# Altium project CW308T_LPC1343.PrjPcb
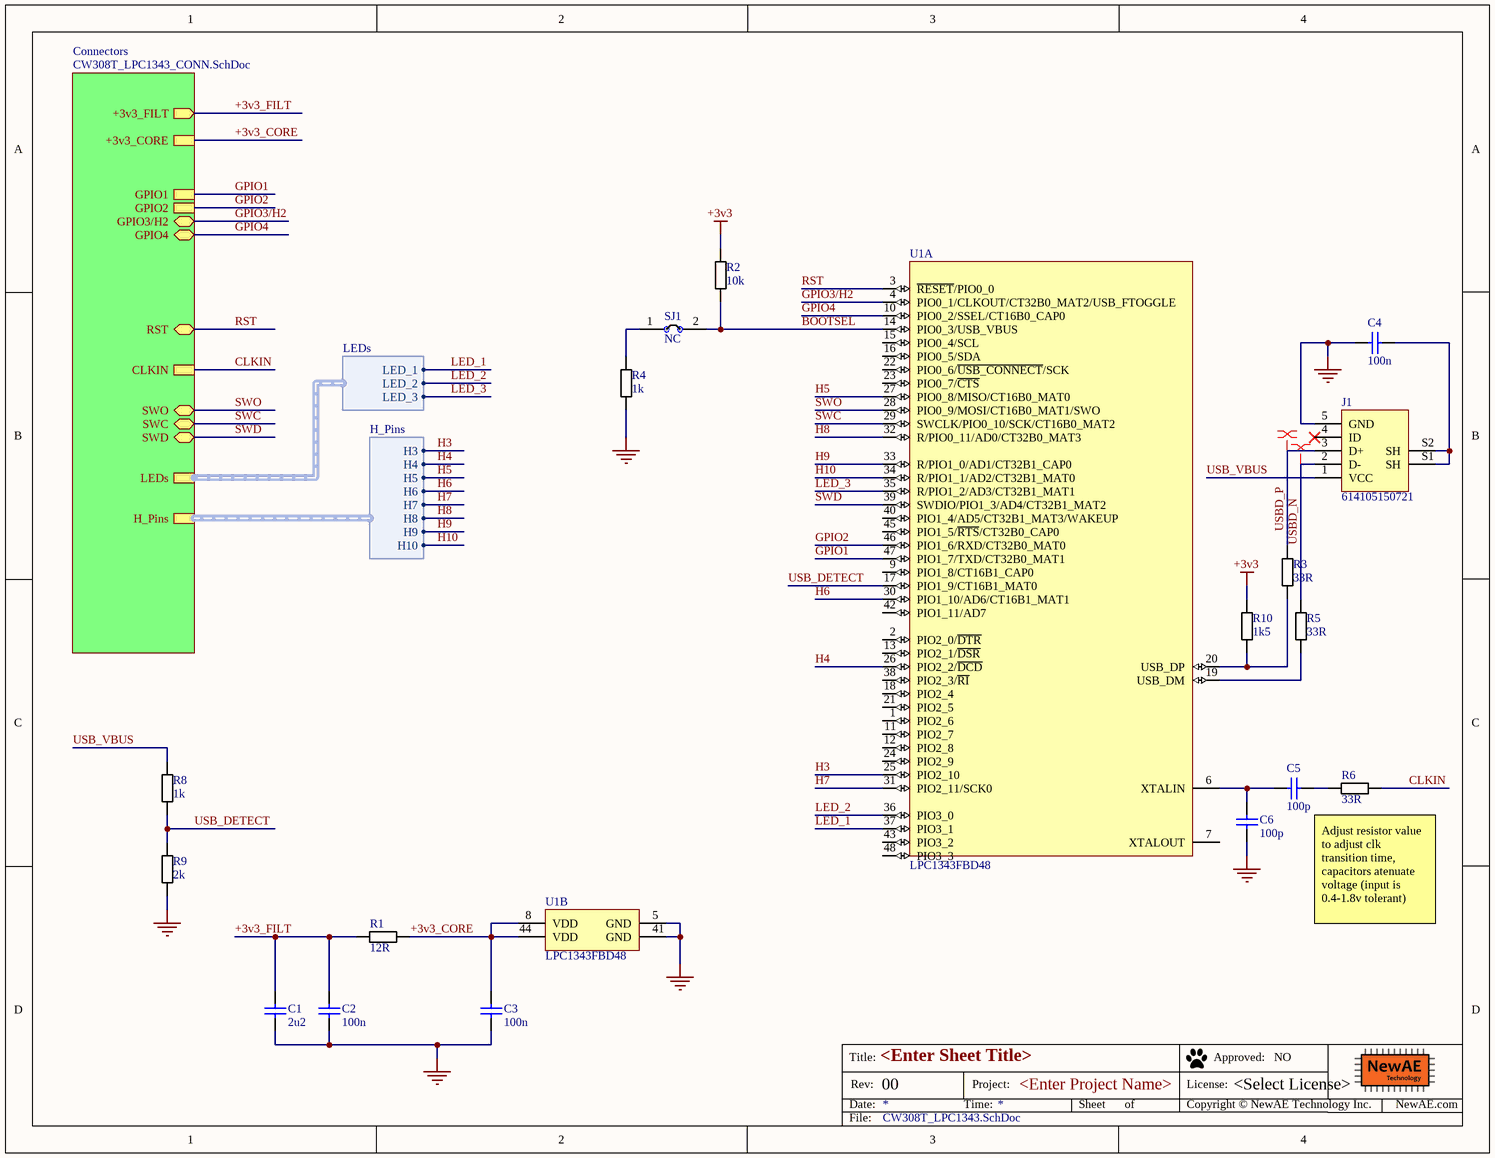
[diagram p0: CW308T_LPC1343.SchDoc]
PrjLicense: <Select License>; PrjName: <Enter Project Name>; PrjRev: 00
2 sheets, 20 parts. Net scope: hierarchical (ports join the sheet entries above them; power ports are global).
Board files: CW308T_LPC1343.PcbDoc, CW308T_LPC1343_PANEL.PcbDoc
Sheets:
  CW308T_LPC1343.SchDoc
    Connectors = CW308T_LPC1343_CONN.SchDoc

## Sheet CW308T_LPC1343.SchDoc: <Enter Sheet Title>
size Letter; Organization: NewAE Technology Inc.; Address1: 1083 Queen St., Suite 196; Address2: Halifax; Address3: NS; Address4: Canada B3H 0B2; SheetApproved: NO

### Parts
C1  2u2  [CAPC0603_M]
C2  100n  [CAPC0603_M]
C3  100n  [CAPC0603_M]
C4  100n  [CAPC0603_M]
C5  100p  [CAPC0603_M]
C6  100p  [CAPC0603_M]
J1  614105150721  [614105150721]
R1  12R  [RESC1608X55N]
R2  10k  [RESC1608X55N]
R3  33R  [RESC1608X55N]
R4  1k  [RESC1608X55N]
R5  33R  [RESC1608X55N]
R6  33R  [RESC1608X55N]
R8  1k  [RESC1608X55N]
R9  2k  [RESC1608X55N]
R10  1k5  [RESC1608X55N]
SJ1  NC  [SJ_2S_NC]  (no BOM)
U1  LPC1343FBD48  (parts A,B of 2)

### Sub-sheets
Connectors = CW308T_LPC1343_CONN.SchDoc: +3v3_CORE, GPIO1, GPIO2, RST (bidir), CLKIN, GPIO3/H2 (bidir), GPIO4 (bidir), SWO (bidir), SWC (bidir), SWD (bidir), +3v3_FILT (out), H_Pins (harness H_Pins), LEDs (harness LEDs)

### Harnesses
H_Pins: H3, H4, H5, H6, H7, H8, H9, H10
LEDs: LED_1, LED_2, LED_3

### Nets
+3v3: R2.1 R10.1
GND: C1.2 C2.2 C3.2 C4.1 C6.2 J1.5(GND) R4.2 R9.2 U1.5(GND) U1.41(GND)
+3v3_CORE: C3.1 R1.2 U1.8(VDD) U1.44(VDD) ; sheet Connectors/+3v3_CORE
+3v3_FILT: C1.1 C2.1 R1.1 ; sheet Connectors/+3v3_FILT
BOOTSEL: R2.2 SJ1.2 U1.14(PIO0_3/USB_VBUS)
CLKIN: R6.2 ; sheet Connectors/CLKIN
GPIO1: U1.47(PIO1_7/TXD/CT32B0_MAT1) ; sheet Connectors/GPIO1
GPIO2: U1.46(PIO1_6/RXD/CT32B0_MAT0) ; sheet Connectors/GPIO2
GPIO3/H2: U1.4(PIO0_1/CLKOUT/CT32B0_MAT2/USB_FTOGGLE) ; sheet Connectors/GPIO3/H2
GPIO4: U1.10(PIO0_2/SSEL/CT16B0_CAP0) ; sheet Connectors/GPIO4
H3: U1.25(PIO2_10) ; sheet Connectors/H_Pins.H3
H4: U1.26(PIO2_2/~{DCD}) ; sheet Connectors/H_Pins.H4
H5: U1.27(PIO0_8/MISO/CT16B0_MAT0) ; sheet Connectors/H_Pins.H5
H6: U1.30(PIO1_10/AD6/CT16B1_MAT1) ; sheet Connectors/H_Pins.H6
H7: U1.31(PIO2_11/SCK0) ; sheet Connectors/H_Pins.H7
H8: U1.32(R/PIO0_11/AD0/CT32B0_MAT3) ; sheet Connectors/H_Pins.H8
H9: U1.33(R/PIO1_0/AD1/CT32B1_CAP0) ; sheet Connectors/H_Pins.H9
H10: U1.34(R/PIO1_1/AD2/CT32B1_MAT0) ; sheet Connectors/H_Pins.H10
LED_1: U1.37(PIO3_1) ; sheet Connectors/LEDs.LED_1
LED_2: U1.36(PIO3_0) ; sheet Connectors/LEDs.LED_2
LED_3: U1.35(R/PIO1_2/AD3/CT32B1_MAT1) ; sheet Connectors/LEDs.LED_3
RST: U1.3(~{RESET}/PIO0_0) ; sheet Connectors/RST
SWC: U1.29(SWCLK/PIO0_10/SCK/CT16B0_MAT2) ; sheet Connectors/SWC
SWD: U1.39(SWDIO/PIO1_3/AD4/CT32B1_MAT2) ; sheet Connectors/SWD
SWO: U1.28(PIO0_9/MOSI/CT16B0_MAT1/SWO) ; sheet Connectors/SWO
USB_DETECT: R8.2 R9.1 U1.17(PIO1_9/CT16B1_MAT0)
USB_VBUS: J1.1(VCC) R8.1
USBD_N: J1.2(D-) R5.1
USBD_P: J1.3(D+) R3.1
NetC4_2: C4.2 J1.S1(SH) J1.S2(SH)
NetC5_1: C5.1 C6.1 U1.6(XTALIN)
NetC5_2: C5.2 R6.1
NetR3_2: R3.2 R10.2 U1.20(USB_DP)
NetR4_1: R4.1 SJ1.1
NetR5_2: R5.2 U1.19(USB_DM)

Not connected (* = marked no-connect by the designer): J1 4(ID)*; U1 1(PIO2_6) 2(PIO2_0/~{DTR}) 7(XTALOUT) 9(PIO1_8/CT16B1_CAP0) 11(PIO2_7) 12(PIO2_8) 13(PIO2_1/~{DSR}) 15(PIO0_4/SCL) 16(PIO0_5/SDA) 18(PIO2_4) 21(PIO2_5) 22(PIO0_6/~{USB_CONNECT}/SCK) 23(PIO0_7/~{CTS}) 24(PIO2_9) 38(PIO2_3/~{RI}) 40(PIO1_4/AD5/CT32B1_MAT3/WAKEUP) 42(PIO1_11/AD7) 43(PIO3_2) 45(PIO1_5/~{RTS}/CT32B0_CAP0) 48(PIO3_3)

### Layout directives
differential pair: USBD_N, USBD_P

### Notes on the sheet
- Adjust resistor value to adjust clk transition time, capacitors atenuate voltage (input is 0.4-1.8v tolerant)
- Title:
- Date:
- Rev:
- Time:
- Project:
- Sheet
- of
- License:
- Copyright © NewAE Technology Inc.
- Approved:
- NewAE.com
- File:

### Library data of the parts
C1 = CCHIP-2u2-0603: 2u2, 0603; Manufacture 1: Samsung; Manufacture Part Number 1: CL10B225KP8NNNC; Component Group: Capacitor; Case-EIA: 0603; Case-Metric: 1608; Rated Voltage: 10VDC; Part Number: CCHIP-2u2-0603; Footprint: 0603; Pin Count: 2; Supplier 1: Digi-Key; Supplier Part Number 1: 1276-1134-2-ND; Value: 2u2; Mounting Technology: SMT; Component Kind: Standard; Component Type: Standard
C2-C4 = CCHIP-100n-0603: 100n, 0603; Manufacture 1: Kemet; Manufacture Part Number 1: C0603C104K5RACTU; Component Group: Capacitor; Case-EIA: 0603; Case-Metric: 1608; Rated Voltage: 50VDC; Part Number: CCHIP-100n-0603; Footprint: 0603; Pin Count: 2; Supplier 1: Digi-Key; Supplier Part Number 1: 399-5089-2-ND; Value: 100n; Mounting Technology: SMT; Component Kind: Standard; Component Type: Standard
C5 C6 = CCHIP-100p-0603: 100p, 0603; Manufacture 1: KEMET; Manufacture Part Number 1: C0603C101K5RACTU; Component Group: Capacitor; Case-EIA: 0603; Case-Metric: 1608; Rated Voltage: 50V; Part Number: CCHIP-100p-0603; Footprint: 0603; Pin Count: 2; Supplier 1: Digi-Key; Supplier Part Number 1: 399-7824-1-ND; Value: 100p; Mounting Technology: SMT; RoHS: Yes; Component Kind: Standard; Component Type: Standard
J1 = 614105150721: USB, 5-pin, Upright; Manufacture 1: Wurth Electronics; Component Group: Connector; PP Material Stack: 0; Part Number: 614105150721; Manufacture Part Number 1: 614105150721; Pin Count: 7; Supplier 1: Digi-Key; Supplier Part Number 1: 732-5958-1-ND; Mounting Technology: Through-hole; RoHS: Yes; Component Kind: Standard; Component Type: Standard; PP Rotation: 0
R1 = RCHIP-12R-0603: 12R res, 0603, 1%, 1/10W; Manufacture 1: Yageo; Manufacture Part Number 1: RC0603FR-0712RL; Component Group: Resistor; Case-EIA: 0603; Case-Metric: 1608; Rated Power: 0.1W; Rated Voltage: 75VDC; Part Number: RCHIP-12R-0603; Footprint: 0603; Pin Count: 2; Supplier 1: Digi-Key; Supplier Part Number 1: 311-12.0HRCT-ND; Value: 12R; Tolerance: 1%; Mounting Technology: SMT; Temperature Range: -55C to 155C; Component Kind: Standard; Component Type: Standard
R2 = RCHIP-10K-0603: 10k res, 0603, 1%, 1/10W; Manufacture 1: Yageo; Manufacture Part Number 1: RC0603FR-0710KL; Component Group: Resistor; Case-EIA: 0603; Case-Metric: 1608; Rated Power: 0.1W; Rated Voltage: 75VDC; Part Number: RCHIP-10K-0603; Footprint: 0603; Pin Count: 2; Supplier 1: Digi-Key; Supplier Part Number 1: 311-10.0KHRCT-ND; Value: 10k; Tolerance: 1%; Mounting Technology: SMT; Temperature Range: -55C to 155C; Component Kind: Standard; Component Type: Standard
R3 R5 R6 = RCHIP-33R-0603: 33R res, 0603, 1%, 1/10W; Manufacture 1: Yageo; Manufacture Part Number 1: RC0603FR-0733RL; Component Group: Resistor; Case-EIA: 0603; Case-Metric: 1608; Rated Power: 0.1W; Rated Voltage: 75VDC; Part Number: RCHIP-33R-0603; Footprint: 0603; Pin Count: 2; Supplier 1: Digi-Key; Supplier Part Number 1: 311-33.0HRCT-ND; Value: 33R; Tolerance: 1%; Mounting Technology: SMT; Temperature Range: -55C to 155C; Component Kind: Standard; Component Type: Standard
R4 R8 = RCHIP-1K-0603: 1k res, 0603, 1%, 1/10W; Manufacture 1: Yageo; Manufacture Part Number 1: RC0603FR-071KL; Component Group: Resistor; Case-EIA: 0603; Case-Metric: 1608; Rated Power: 0.1W; Rated Voltage: 75VDC; Part Number: RCHIP-1K-0603; Footprint: 0603; Pin Count: 2; Supplier 1: Digi-Key; Supplier Part Number 1: 311-1.00KHRCT-ND; Value: 1k; Tolerance: 1%; Mounting Technology: SMT; Temperature Range: -55C to 155C; Component Kind: Standard; Component Type: Standard
R9 = RCHIP-2K-0603: 2k res, 0603, 1%, 1/10W; Manufacture 1: Yageo; Manufacture Part Number 1: RC0603FR-072KL; Component Group: Resistor; Case-EIA: 0603; Case-Metric: 1608; Rated Power: 0.1W; Rated Voltage: 75VDC; Part Number: RCHIP-2K-0603; Footprint: 0603; Pin Count: 2; Supplier 1: Digi-Key; Supplier Part Number 1: 311-2.00KHRCT-ND; Value: 2k; Tolerance: 1%; Mounting Technology: SMT; Temperature Range: -55C to 155C; Component Kind: Standard; Component Type: Standard
R10 = RCHIP-1K5-0603: 1k5 res, 0603, 1%, 1/10W; Manufacture 1: Yageo; Manufacture Part Number 1: RC0603FR-071K5L; Component Group: Resistor; Case-EIA: 0603; Case-Metric: 1608; Rated Power: 0.1W; Rated Voltage: 75VDC; Part Number: RCHIP-1K5-0603; Footprint: 0603; Pin Count: 2; Supplier 1: Digi-Key; Supplier Part Number 1: 311-1.50KHRCT-ND; Value: 1k5; Tolerance: 1%; Mounting Technology: SMT; Temperature Range: -55C to 155C; Component Kind: Standard; Component Type: Standard
SJ1 = SJ_2S: Solder Jumper, NC; Component Group: PCB Feature; Part Number: SJ_2S; Pin Count: 2; Mounting Technology: COPPER; Component Type: Standard (No BOM)

## Sheet CW308T_LPC1343_CONN.SchDoc: <Enter Sheet Title>
size Letter; Organization: NewAE Technology Inc.; Address1: 1083 Queen St., Suite 196; Address2: Halifax; Address3: NS; Address4: Canada B3H 0B2; SheetApproved: NO
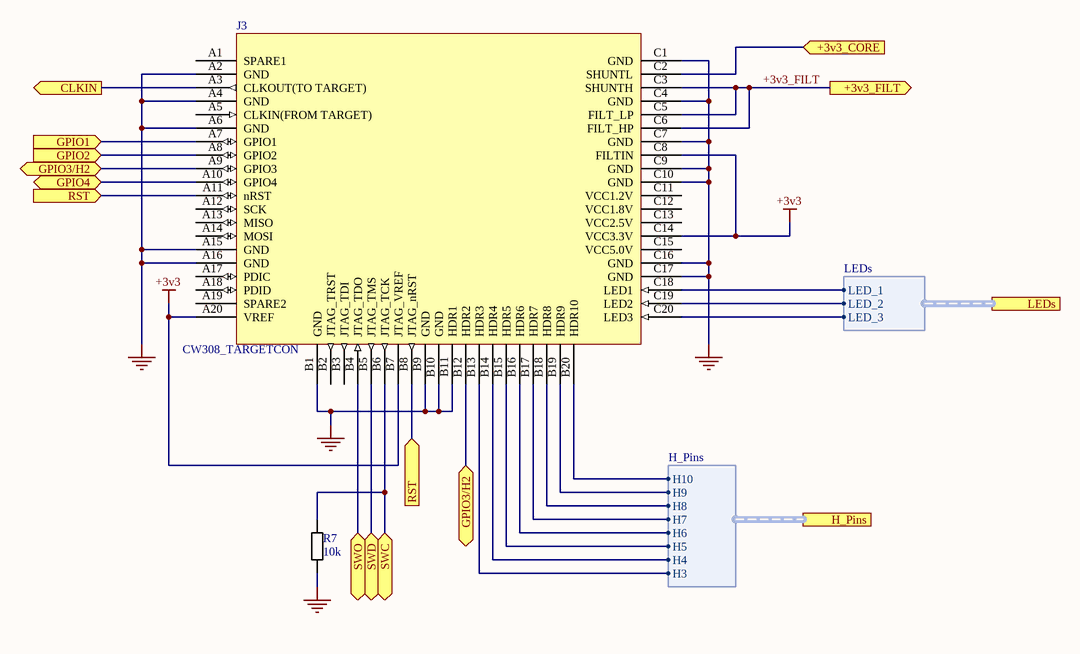
[diagram p1: CW308T_LPC1343_CONN.SchDoc]

### Parts
J3  CW308_TARGETCON  [CW308_TBOARD_CONN]
R7  10k  [RESC1608X55N]

### Ports
+3v3_CORE (in), +3v3_FILT (out), CLKIN (out), GPIO1 (in), GPIO2 (in), GPIO3/H2 (bidir), GPIO4 (bidir), H_Pins (harness H_Pins), LEDs (harness LEDs), RST (in), SWC (bidir), SWD (bidir), SWO (bidir)

### Harnesses
H_Pins: H10, H3, H4, H5, H6, H7, H8, H9
LEDs: LED_1, LED_2, LED_3

### Nets
+3v3: J3.A20(VREF) J3.B7(JTAG_VREF) J3.C8(FILTIN) J3.C14(VCC3.3V)
GND: J3.A2(GND) J3.A4(GND) J3.A6(GND) J3.A15(GND) J3.A16(GND) J3.B1(GND) J3.B9(GND) J3.B10(GND) J3.B11(HDR1) J3.C1(GND) J3.C4(GND) J3.C7(GND) J3.C9(GND) J3.C10(GND) J3.C16(GND) J3.C17(GND) R7.2
+3v3_CORE: J3.C2(SHUNTL) ; port +3v3_CORE
+3v3_FILT: J3.C3(SHUNTH) J3.C5(FILT_LP) J3.C6(FILT_HP) ; port +3v3_FILT
CLKIN: J3.A3(CLKOUT(TO_TARGET)) ; port CLKIN
GPIO1: J3.A7(GPIO1) ; port GPIO1
GPIO2: J3.A8(GPIO2) ; port GPIO2
GPIO3/H2: J3.A9(GPIO3) J3.B12(HDR2) ; port GPIO3/H2
GPIO4: J3.A10(GPIO4) ; port GPIO4
H3: J3.B13(HDR3) ; port H_Pins.H3
H4: J3.B14(HDR4) ; port H_Pins.H4
H5: J3.B15(HDR5) ; port H_Pins.H5
H6: J3.B16(HDR6) ; port H_Pins.H6
H7: J3.B17(HDR7) ; port H_Pins.H7
H8: J3.B18(HDR8) ; port H_Pins.H8
H9: J3.B19(HDR9) ; port H_Pins.H9
H10: J3.B20(HDR10) ; port H_Pins.H10
LED_1: J3.C18(LED1) ; port LEDs.LED_1
LED_2: J3.C19(LED2) ; port LEDs.LED_2
LED_3: J3.C20(LED3) ; port LEDs.LED_3
RST: J3.A11(nRST) J3.B8(JTAG_nRST) ; port RST
SWC: J3.B6(JTAG_TCK) R7.1 ; port SWC
SWD: J3.B5(JTAG_TMS) ; port SWD
SWO: J3.B4(JTAG_TDO) ; port SWO

Not connected (* = marked no-connect by the designer): J3 A1(SPARE1) A5(CLKIN(FROM_TARGET)) A12(SCK) A13(MISO) A14(MOSI) A17(PDIC) A18(PDID) A19(SPARE2) B2(JTAG_TRST) B3(JTAG_TDI) C11(VCC1.2V) C12(VCC1.8V) C13(VCC2.5V) C15(VCC5.0V)

### Notes on the sheet
- Title:
- Date:
- Rev:
- Time:
- Project:
- Sheet
- of
- License:
- Copyright © NewAE Technology Inc.
- Approved:
- NewAE.com
- File:

### Library data of the parts
J3 = CW308_TBOARD: CW308 "Standard" Target Board Connector; Component Group: Mechanical; Pitch: 2.54mm; Part Number: CW308_TBOARD; Pin Count: 60; Mounting Technology: Through-hole; Component Kind: Standard; Component Type: Standard
R7 = RCHIP-10K-0603: as R2 on sheet CW308T_LPC1343; Part Number: RCHIP-10K-0603; Footprint: 0603; Pin Count: 2; Supplier 1: Digi-Key; Supplier Part Number 1: 311-10.0KHRCT-ND; Value: 10k; Tolerance: 1%; Mounting Technology: SMT; Temperature Range: -55C to 155C; Component Kind: Standard; Component Type: Standard

## Nets that join several sheets
+3v3: CW308T_LPC1343 (R2.1 R10.1), CW308T_LPC1343_CONN (J3.A20 J3.B7 J3.C8 J3.C14)
GND: CW308T_LPC1343 (10 pins), CW308T_LPC1343_CONN (17 pins)
+3v3_CORE: CW308T_LPC1343 (C3.1 R1.2 U1.8 U1.44), CW308T_LPC1343_CONN (J3.C2)
+3v3_FILT: CW308T_LPC1343 (C1.1 C2.1 R1.1), CW308T_LPC1343_CONN (J3.C3 J3.C5 J3.C6)
CLKIN: CW308T_LPC1343 (R6.2), CW308T_LPC1343_CONN (J3.A3)
GPIO1: CW308T_LPC1343 (U1.47), CW308T_LPC1343_CONN (J3.A7)
GPIO2: CW308T_LPC1343 (U1.46), CW308T_LPC1343_CONN (J3.A8)
GPIO3/H2: CW308T_LPC1343 (U1.4), CW308T_LPC1343_CONN (J3.A9 J3.B12)
GPIO4: CW308T_LPC1343 (U1.10), CW308T_LPC1343_CONN (J3.A10)
H3: CW308T_LPC1343 (U1.25), CW308T_LPC1343_CONN (J3.B13)
H4: CW308T_LPC1343 (U1.26), CW308T_LPC1343_CONN (J3.B14)
H5: CW308T_LPC1343 (U1.27), CW308T_LPC1343_CONN (J3.B15)
H6: CW308T_LPC1343 (U1.30), CW308T_LPC1343_CONN (J3.B16)
H7: CW308T_LPC1343 (U1.31), CW308T_LPC1343_CONN (J3.B17)
H8: CW308T_LPC1343 (U1.32), CW308T_LPC1343_CONN (J3.B18)
H9: CW308T_LPC1343 (U1.33), CW308T_LPC1343_CONN (J3.B19)
H10: CW308T_LPC1343 (U1.34), CW308T_LPC1343_CONN (J3.B20)
LED_1: CW308T_LPC1343 (U1.37), CW308T_LPC1343_CONN (J3.C18)
LED_2: CW308T_LPC1343 (U1.36), CW308T_LPC1343_CONN (J3.C19)
LED_3: CW308T_LPC1343 (U1.35), CW308T_LPC1343_CONN (J3.C20)
RST: CW308T_LPC1343 (U1.3), CW308T_LPC1343_CONN (J3.A11 J3.B8)
SWC: CW308T_LPC1343 (U1.29), CW308T_LPC1343_CONN (J3.B6 R7.1)
SWD: CW308T_LPC1343 (U1.39), CW308T_LPC1343_CONN (J3.B5)
SWO: CW308T_LPC1343 (U1.28), CW308T_LPC1343_CONN (J3.B4)

## Assembly variants
Production CW308T_LPC1343: not fitted C4 J1 R3 R5 R8 R9 R10